# EAGLE design kopping_c (EAGLE 7.2.0)
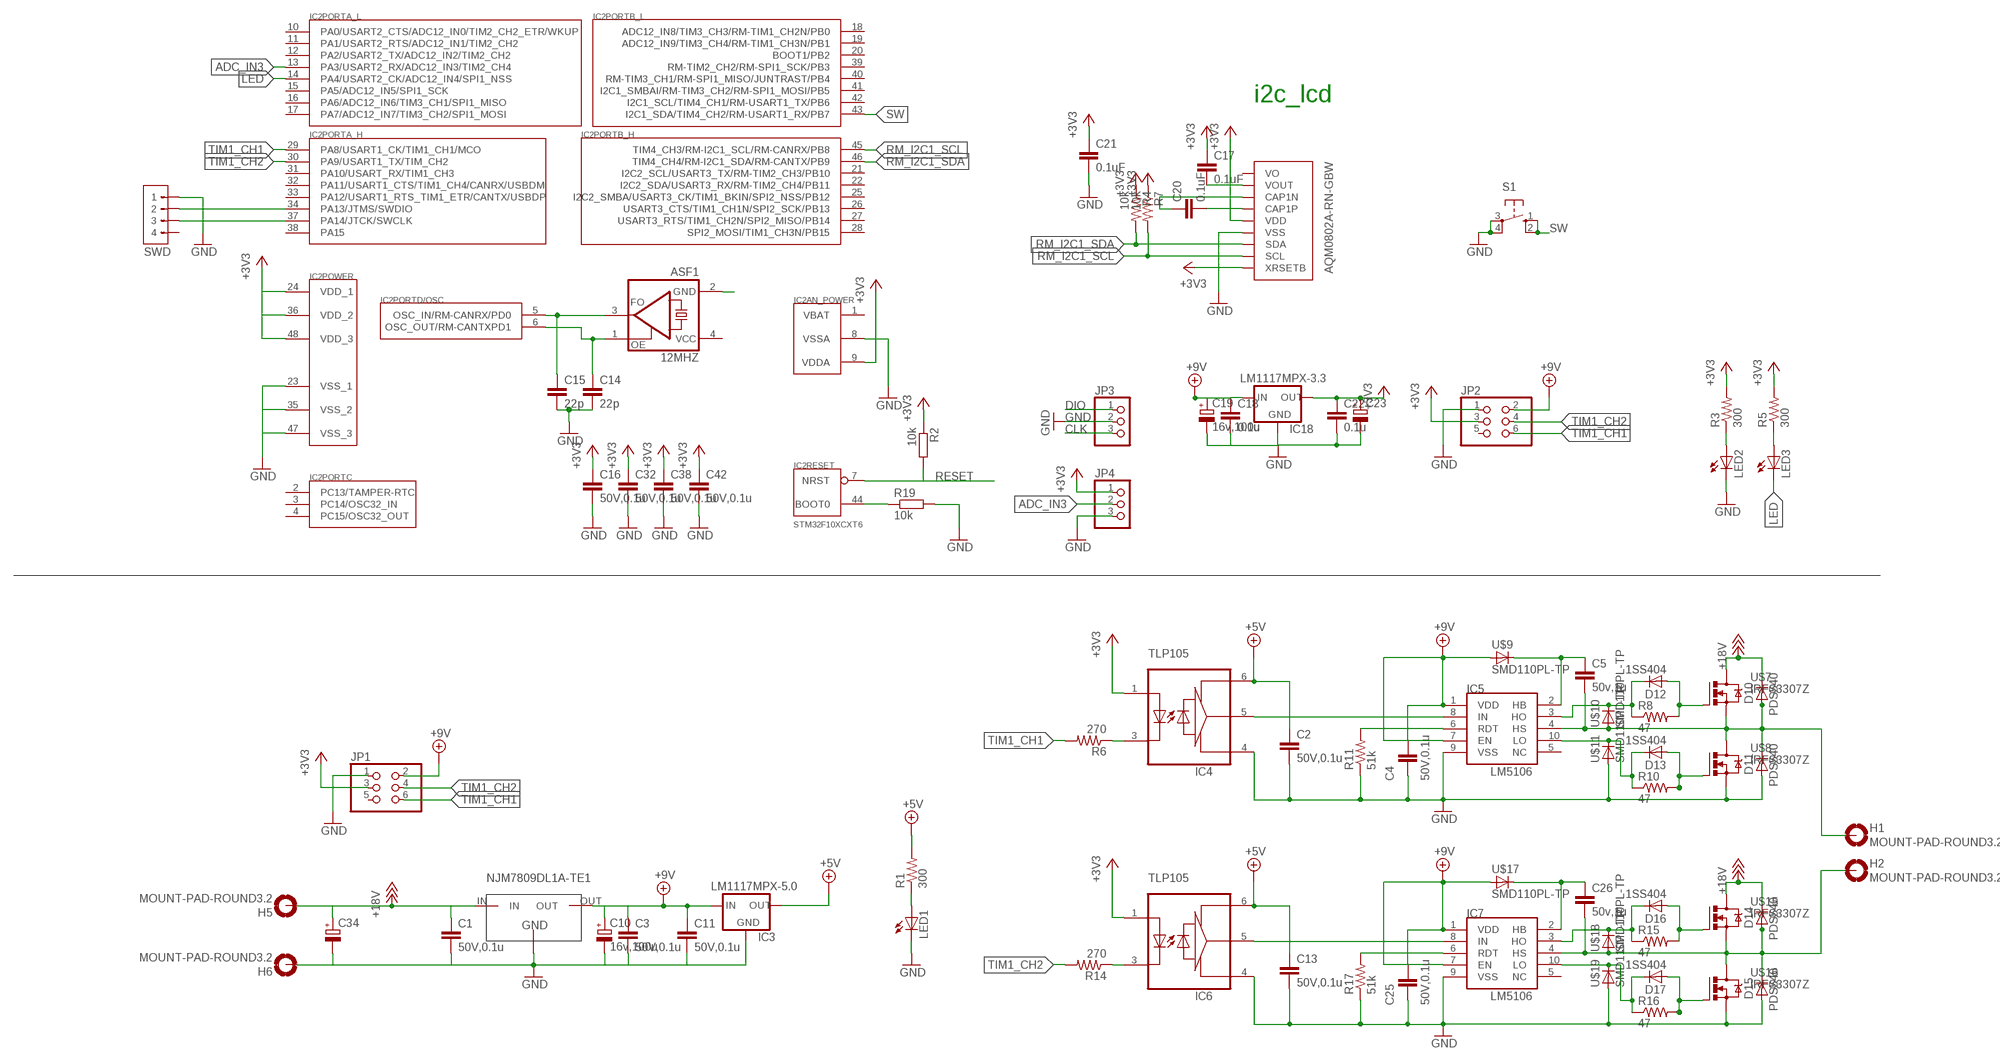
[diagram p0: schematic, sheet 1]

## Parts
12MHZ  ASF1  [ASF]
AQM0802A-RN-GBW  AQM0802A-RN-GBW  [AQM0802]
C1  50V,0.1u  C-EUC0603  [C0603]
C2  50V,0.1u  C-EUC0603  [C0603]
C3  50V,0.1u  C-EUC0603  [C0603]
C4  50V,0.1u  C-EUC0603  [C0603]
C5  50v,1u  C-EUC0603  [C0603]
C10  16v,100u  CPOL-EU153CLV-0605  [153CLV-0605]
C11  50V,0.1u  C-EUC0603  [C0603]
C13  50V,0.1u  C-EUC0603  [C0603]
C14  22p  C-EUC0603  [C0603]
C15  22p  C-EUC0603  [C0603]
C16  50V,0.1u  C-EUC0603K  [C0603K]
C17  0.1uF  C-EUC0603  [C0603]
C18  0.1u  C-EUC0603  [C0603]
C19  16v,100u  CPOL-EU153CLV-0605  [153CLV-0605]
C20  0.1uF  C-EUC0603  [C0603]
C21  0.1uF  C-EUC0603  [C0603]
C22  0.1u  C-EUC0603K  [C0603K]
C23  CPOL-EU153CLV-0505  [153CLV-0505]
C25  50V,0.1u  C-EUC0603  [C0603]
C26  50v,1u  C-EUC0603  [C0603]
C32  50V,0.1u  C-EUC0603K  [C0603K]
C34  CPOL-EUE7.5-16  [E7,5-16]
C38  50V,0.1u  C-EUC0603K  [C0603K]
C42  50V,0.1u  C-EUC0603K  [C0603K]
D10  PDS540  [POWER_DI_5]
D11  PDS540  [POWER_DI_5]
D12  1SS404  [USC(1.25X2.5)]
D13  1SS404  [USC(1.25X2.5)]
D14  PDS540  [POWER_DI_5]
D15  PDS540  [POWER_DI_5]
D16  1SS404  [USC(1.25X2.5)]
D17  1SS404  [USC(1.25X2.5)]
H1  MOUNT-PAD-ROUND3.2  [3,2-PAD]
H2  MOUNT-PAD-ROUND3.2  [3,2-PAD]
H5  MOUNT-PAD-ROUND3.2  [3,2-PAD]
H6  MOUNT-PAD-ROUND3.2  [3,2-PAD]
IC2  STM32F10XCXT6  [TQFP48]
IC3  LM1117MPX-5.0  LM1117  [SOT223]
IC4  TLP105  TLP117  [MFSOP6]
IC5  LM5106  [MSOP10]
IC6  TLP105  TLP117  [MFSOP6]
IC7  LM5106  [MSOP10]
IC18  LM1117MPX-3.3  LM1117  [SOT223]
JP1  PINHD-2X3  [2X03]
JP2  PINHD-2X3  [2X03]
JP3  PINHD-1X3/90  [1X03/90]
JP4  PINHD-1X3/90  [1X03/90]
LED1  LEDCHIPLED_1206  [CHIPLED_1206]
LED2  LEDCHIPLED_1206  [CHIPLED_1206]
LED3  LEDCHIPLED_1206  [CHIPLED_1206]
R1  300  R-US_M2012  [M2012]
R2  10k  R-EU_R0603  [R0603]
R3  300  R-US_M2012  [M2012]
R4  10k  R-US_R0603  [R0603]
R5  300  R-US_M2012  [M2012]
R6  270  R-US_R0603  [R0603]
R7  10k  R-US_R0603  [R0603]
R8  47  R-US_R0603  [R0603]
R10  47  R-US_R0603  [R0603]
R11  51k  R-US_R0603  [R0603]
R14  270  R-US_R0603  [R0603]
R15  47  R-US_R0603  [R0603]
R16  47  R-US_R0603  [R0603]
R17  51k  R-US_R0603  [R0603]
R19  10k  R-EU_R0603  [R0603]
S1  10-XX  [B3F-10XX]
SWD  TOP_TYPE_4PIN  [TOP_TYPE_4PIN]
U$3  TO252  [TO252]
U$7  IRFS3307Z  [IRFS3307Z]
U$8  IRFS3307Z  [IRFS3307Z]
U$9  SMD110PL-TP  [SOD123]
U$10  SMD110PL-TP  [SOD123]
U$11  SMD110PL-TP  [SOD123]
U$15  IRFS3307Z  [IRFS3307Z]
U$16  IRFS3307Z  [IRFS3307Z]
U$17  SMD110PL-TP  [SOD123]
U$18  SMD110PL-TP  [SOD123]
U$19  SMD110PL-TP  [SOD123]

## Nets
+3V3: AQM0802A-RN-GBW.P$5(VDD) AQM0802A-RN-GBW.P$9(XRSETB) C16.1 C17.1 C21.1 C22.1 C23.+ C32.1 C38.1 C42.1 IC2.9(AN_POWER:VDDA) IC2.24(POWER:VDD_1) IC2.36(POWER:VDD_2) IC2.48(POWER:VDD_3) IC4.1 IC6.1 IC18.2(OUT1) IC18.4(OUT) JP1.3 JP2.3 JP4.1 R2.1 R3.2 R4.1 R5.2 R7.1
+5V: C2.1 C13.1 IC3.2(OUT1) IC3.4(OUT) IC4.6(VCC) IC6.6(VCC) R1.2
+9V: C3.1 C4.1 C10.+ C11.1 C18.1 C19.+ C25.1 IC3.3(IN) IC5.1(VDD) IC5.7(EN) IC7.1(VDD) IC7.7(EN) IC18.3(IN) JP1.2 JP2.2 U$3.OUT U$9.A U$17.A
+18V: C1.1 C34.+ D10.K(C) D14.K(C) H5.B3,2(MOUNT) U$3.IN U$7.2(D1) U$15.2(D1)
ADC_IN3: IC2.13(PORTA_L:PA3/USART2_RX/ADC12_IN3/TIM2_CH4) JP4.2
CLK: IC2.37(PORTA_H:PA14/JTCK/SWCLK) JP3.3 SWD.3
DIO: IC2.34(PORTA_H:PA13/JTMS/SWDIO) JP3.1 SWD.2
GND: AQM0802A-RN-GBW.P$6(VSS) C1.2 C2.2 C3.2 C4.2 C10.- C11.2 C13.2 C14.2 C15.2 C16.2 C18.2 C19.- C21.2 C22.2 C23.- C25.2 C32.2 C34.- C38.2 C42.2 D11.A1 D11.A2(A) D15.A1 D15.A2(A) H6.B3,2(MOUNT) IC2.8(AN_POWER:VSSA) IC2.23(POWER:VSS_1) IC2.35(POWER:VSS_2) IC2.47(POWER:VSS_3) IC3.1(GND) IC4.4(GND) IC5.9(VSS) IC6.4(GND) IC7.9(VSS) IC18.1(GND) JP1.1 JP2.1 JP3.2 JP4.3 LED1.C LED2.C R11.1 R17.1 R19.2 S1.3(P) S1.4(P1) SWD.1 U$3.GND U$8.3(S) U$11.A U$16.3(S) U$19.A
LED: IC2.14(PORTA_L:PA4/USART2_CK/ADC12_IN4/SPI1_NSS) LED3.C
N$1: AQM0802A-RN-GBW.P$4(CAP1P) C20.2
N$2: AQM0802A-RN-GBW.P$3(CAP1N) C20.1
N$3: LED1.A R1.1
N$7: LED2.A R3.1
N$9: IC2.44(RESET:BOOT0) R19.1
N$10 [VCC]: 12MHZ.2(GND)
N$11: 12MHZ.3(FO) C15.1 IC2.5(PORTD/OSC:OSC_IN/RM-CANRX/PD0)
N$12: 12MHZ.1(OE) C14.1 IC2.6(PORTD/OSC:OSC_OUT/RM-CANTXPD1)
N$13: IC4.3 R6.1
N$14: IC6.3 R14.1
N$15: AQM0802A-RN-GBW.P$2(VOUT) C17.2
N$16: LED3.A R5.1
N$17: IC4.5 IC5.8(IN)
N$18: C5.2 D10.A1 D10.A2(A) D11.K(C) H1.B3,2(MOUNT) IC5.4(HS) U$7.3(S) U$8.2(D1) U$10.A
N$19: D12.A R8.2 U$7.1(G1)
N$20: D13.A R10.2 U$8.1(G1)
N$21: D12.K(C) IC5.3(HO) R8.1 U$10.K(C)
N$22: D13.K(C) IC5.10(LO) R10.1 U$11.K(C)
N$23: C5.1 IC5.2(HB) U$9.K(C)
N$24: IC5.6(RDT) R11.2
N$28: IC6.5 IC7.8(IN)
N$29: C26.2 D14.A1 D14.A2(A) D15.K(C) H2.B3,2(MOUNT) IC7.4(HS) U$15.3(S) U$16.2(D1) U$18.A
N$32: D16.A R15.2 U$15.1(G1)
N$33: D17.A R16.2 U$16.1(G1)
N$35: D16.K(C) IC7.3(HO) R15.1 U$18.K(C)
N$36: D17.K(C) IC7.10(LO) R16.1 U$19.K(C)
N$37: C26.1 IC7.2(HB) U$17.K(C)
N$39: IC7.6(RDT) R17.2
RESET: IC2.7(RESET:NRST) R2.2
RM_I2C1_SCL: AQM0802A-RN-GBW.P$8(SCL) IC2.45(PORTB_H:TIM4_CH3/RM-I2C1_SCL/RM-CANRX/PB8) R7.2
RM_I2C1_SDA: AQM0802A-RN-GBW.P$7(SDA) IC2.46(PORTB_H:TIM4_CH4/RM-I2C1_SDA/RM-CANTX/PB9) R4.2
SW: IC2.43(PORTB_L:I2C1_SDA/TIM4_CH2/RM-USART1_RX/PB7) S1.1(S) S1.2(S1)
TIM1_CH1: IC2.29(PORTA_H:PA8/USART1_CK/TIM1_CH1/MCO) JP1.6 JP2.6 R6.2
TIM1_CH2: IC2.30(PORTA_H:PA9/USART1_TX/TIM_CH2) JP1.4 JP2.4 R14.2
Unconnected: AQM0802A-RN-GBW.P$1(VO) IC2.2(PORTC:PC13/TAMPER-RTC) IC2.3(PORTC:PC14/OSC32_IN) IC2.4(PORTC:PC15/OSC32_OUT) IC2.10(PORTA_L:PA0/USART2_CTS/ADC12_IN0/TIM2_CH2_ETR/WKUP) IC2.11(PORTA_L:PA1/USART2_RTS/ADC12_IN1/TIM2_CH2) IC2.12(PORTA_L:PA2/USART2_TX/ADC12_IN2/TIM2_CH2) IC2.15(PORTA_L:PA5/ADC12_IN5/SPI1_SCK) IC2.16(PORTA_L:PA6/ADC12_IN6/TIM3_CH1/SPI1_MISO) IC2.17(PORTA_L:PA7/ADC12_IN7/TIM3_CH2/SPI1_MOSI) IC2.18(PORTB_L:ADC12_IN8/TIM3_CH3/RM-TIM1_CH2N/PB0) IC2.19(PORTB_L:ADC12_IN9/TIM3_CH4/RM-TIM1_CH3N/PB1) IC2.20(PORTB_L:BOOT1/PB2) IC2.21(PORTB_H:I2C2_SCL/USART3_TX/RM-TIM2_CH3/PB10) IC2.22(PORTB_H:I2C2_SDA/USART3_RX/RM-TIM2_CH4/PB11) IC2.25(PORTB_H:I2C2_SMBA/USART3_CK/TIM1_BKIN/SPI2_NSS/PB12) IC2.26(PORTB_H:USART3_CTS/TIM1_CH1N/SPI2_SCK/PB13) IC2.27(PORTB_H:USART3_RTS/TIM1_CH2N/SPI2_MISO/PB14) IC2.28(PORTB_H:SPI2_MOSI/TIM1_CH3N/PB15) IC2.31(PORTA_H:PA10/USART_RX/TIM1_CH3) IC2.32(PORTA_H:PA11/USART1_CTS/TIM1_CH4/CANRX/USBDM) IC2.33(PORTA_H:PA12/USART1_RTS_TIM1_ETR/CANTX/USBDP) IC2.38(PORTA_H:PA15) IC2.39(PORTB_L:RM-TIM2_CH2/RM-SPI1_SCK/PB3) IC2.40(PORTB_L:RM-TIM3_CH1/RM-SPI1_MISO/JUNTRAST/PB4) IC2.41(PORTB_L:I2C1_SMBAI/RM-TIM3_CH2/RM-SPI1_MOSI/PB5) IC2.42(PORTB_L:I2C1_SCL/TIM4_CH1/RM-USART1_TX/PB6) IC5.5(NC) IC7.5(NC) JP1.5 JP2.5 SWD.4

## Notes on the sheet
- i2c_lcd
- TLP105
- TLP105

## Power pins joined to a net without a drawn wire
VBAT: IC2.1(AN_POWER:VBAT)
VCC: 12MHZ.4(VCC)

## Library data of the parts
12MHZ = crystal:ASF*: CRYSTAL CLOCK OSCILLATORS 5.0 Vdc or 3.3 Vdc - LOW PROFILE ULTRA MINIATURE CERAMIC SURFACE MOUNT Source: http://www.abracon.com/Oscillators/asf1-L-L1.pdf
AQM0802A-RN-GBW = densikit:AQM0802A-RN-GBW
C1-C5 C11 C13-C15 C18 C25 C26 = rcl:C-EU: CAPACITOR, European symbol
C10 C19 C23 C34 = rcl:CPOL-EU: POLARIZED CAPACITOR, European symbol
C16 C17 C20-C22 C32 C38 C42 = resistor:C-EU: CAPACITOR, European symbol
D10 D11 D14 D15 = Diode:PDS540
D12 D13 D16 D17 = Diode:1SS404
H1 H2 H5 H6 = holes:MOUNT-PAD-ROUND: MOUNTING PAD, round
IC2 = stm32:STM32F10XCXT6: ST STM32F101/103 48pin LQFP
IC3 IC18 = VoltageRegulator:LM1117
IC4 IC6 = PhotoCoupler:TLP117
IC5 IC7 = MotorDriver5x:LM5106
JP1 JP2 = pinhead:PINHD-2X3: PIN HEADER
JP3 JP4 = pinhead:PINHD-1X3: PIN HEADER
LED1-LED3 = led:LED: LED OSRAM: - CHIPLED LG R971, LG N971, LY N971, LG Q971, LY Q971, LO R971, LY R971 LH N974, LH R974 LS Q976, LO Q976, LY Q976 LO Q996 - Hyper CHIPLED LW Q18S LB Q993, LB Q99A, LB R99A - SideLED LS A670, LO A670, LY A670, LG A670, LP A670 LB A673, LV A673, LT A673, LW A673 LH A674 LY A675 LS A676, LA A676, LO A676, LY A676, LW A676 LS A679, LY A679, LG A679 - Hyper Micro SIDELED® LS Y876, LA Y876, LO Y876, LY Y876 LT Y87S - SmartLED LW L88C, LW L88S LB L89C, LB L89S, LG L890 LS L89K, LO L89K, LY L89K LS L896, LA L896, LO L896, LY L896 - TOPLED LS T670, LO T670, LY T670, LG T670, LP T670 LSG T670, LSP T670, LSY T670, LOP T670, LYG T670 LG T671, LOG T671, LSG T671 LB T673, LV T673, LT T673, LW T673 LH T674 LS T676, LA T676, LO T676, LY T676, LB T676, LH T676, LSB T676, LW T676 LB T67C, LV T67C, LT T67C, LS T67K, LO T67K, LY T67K, LW E67C LS E67B, LA E67B, LO E67B, LY E67B, LB E67C, LV E67C, LT E67C LW T67C LS T679, LY T679, LG T679 LS T770, LO T770, LY T770, LG T770, LP T770 LB T773, LV T773, LT T773, LW T773 LH T774 LS E675, LA E675, LY E675, LS T675 LS T776, LA T776, LO T776, LY T776, LB T776 LHGB T686 LT T68C, LB T68C - Hyper Mini TOPLED® LB M676 - Mini TOPLED Santana® LG M470 LS M47K, LO M47K, LY M47K Source: http://www.osram.convergy.de LUXEON: - LUMILED® LXK2-PW12-R00, LXK2-PW12-S00, LXK2-PW14-U00, LXK2-PW14-V00 LXK2-PM12-R00, LXK2-PM12-S00, LXK2-PM14-U00 LXK2-PE12-Q00, LXK2-PE12-R00, LXK2-PE12-S00, LXK2-PE14-T00, LXK2-PE14-U00 LXK2-PB12-K00, LXK2-PB12-L00, LXK2-PB12-M00, LXK2-PB14-N00, LXK2-PB14-P00, LXK2-PB14-Q00 LXK2-PR12-L00, LXK2-PR12-M00, LXK2-PR14-Q00, LXK2-PR14-R00 LXK2-PD12-Q00, LXK2-PD12-R00, LXK2-PD12-S00 LXK2-PH12-R00, LXK2-PH12-S00 LXK2-PL12-P00, LXK2-PL12-Q00, LXK2-PL12-R00 Source: www.luxeon.com KINGBRIGHT: KA-3528ASYC Source: www.kingbright.com
R1 R3 R5 R11 R17 = rcl:R-US_: RESISTOR, American symbol
R2 R19 = rcl:R-EU_: RESISTOR, European symbol
R4 R6-R8 R10 R14-R16 = resistor:R-US_: RESISTOR, American symbol
S1 = switch-omron:10-XX: OMRON SWITCH; MPN: B3F-1000; OC_FARNELL: 176432; OC_NEWARK: 36M3542
SWD = GHconnector:TOP_TYPE_4PIN
U$3 = to252:TO252
U$7 U$8 U$15 U$16 = IRFS3307Z:IRFS3307Z
U$9-U$11 U$17-U$19 = SMD110PL-TP:SMD110PL-TP

## Board
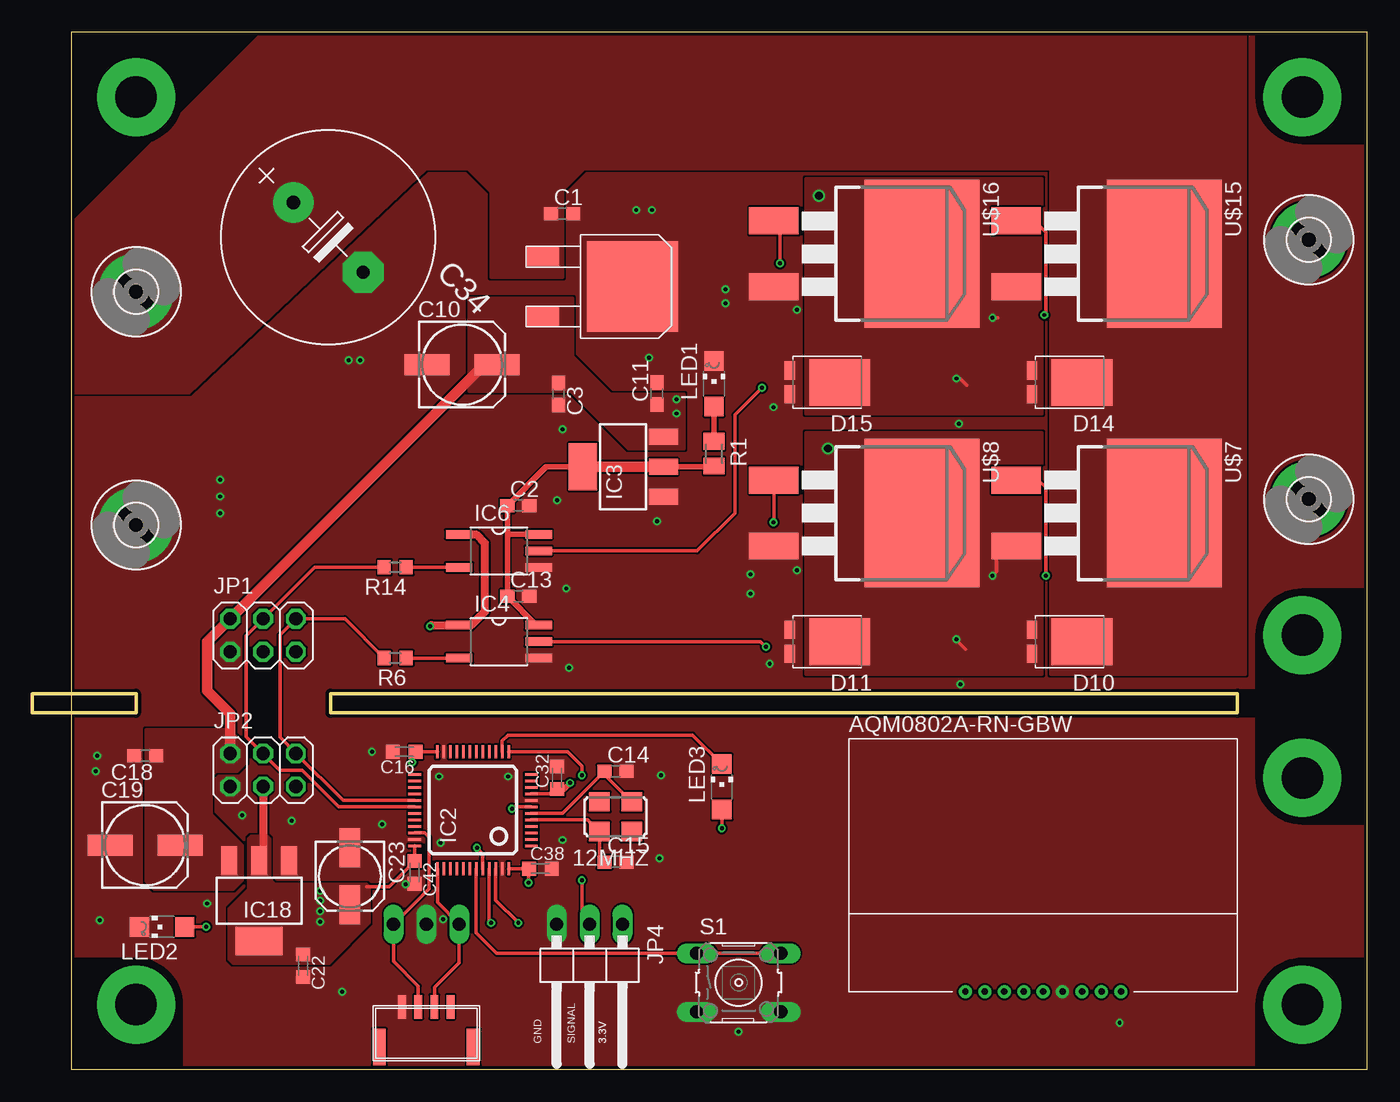
[diagram p1: board, top side]
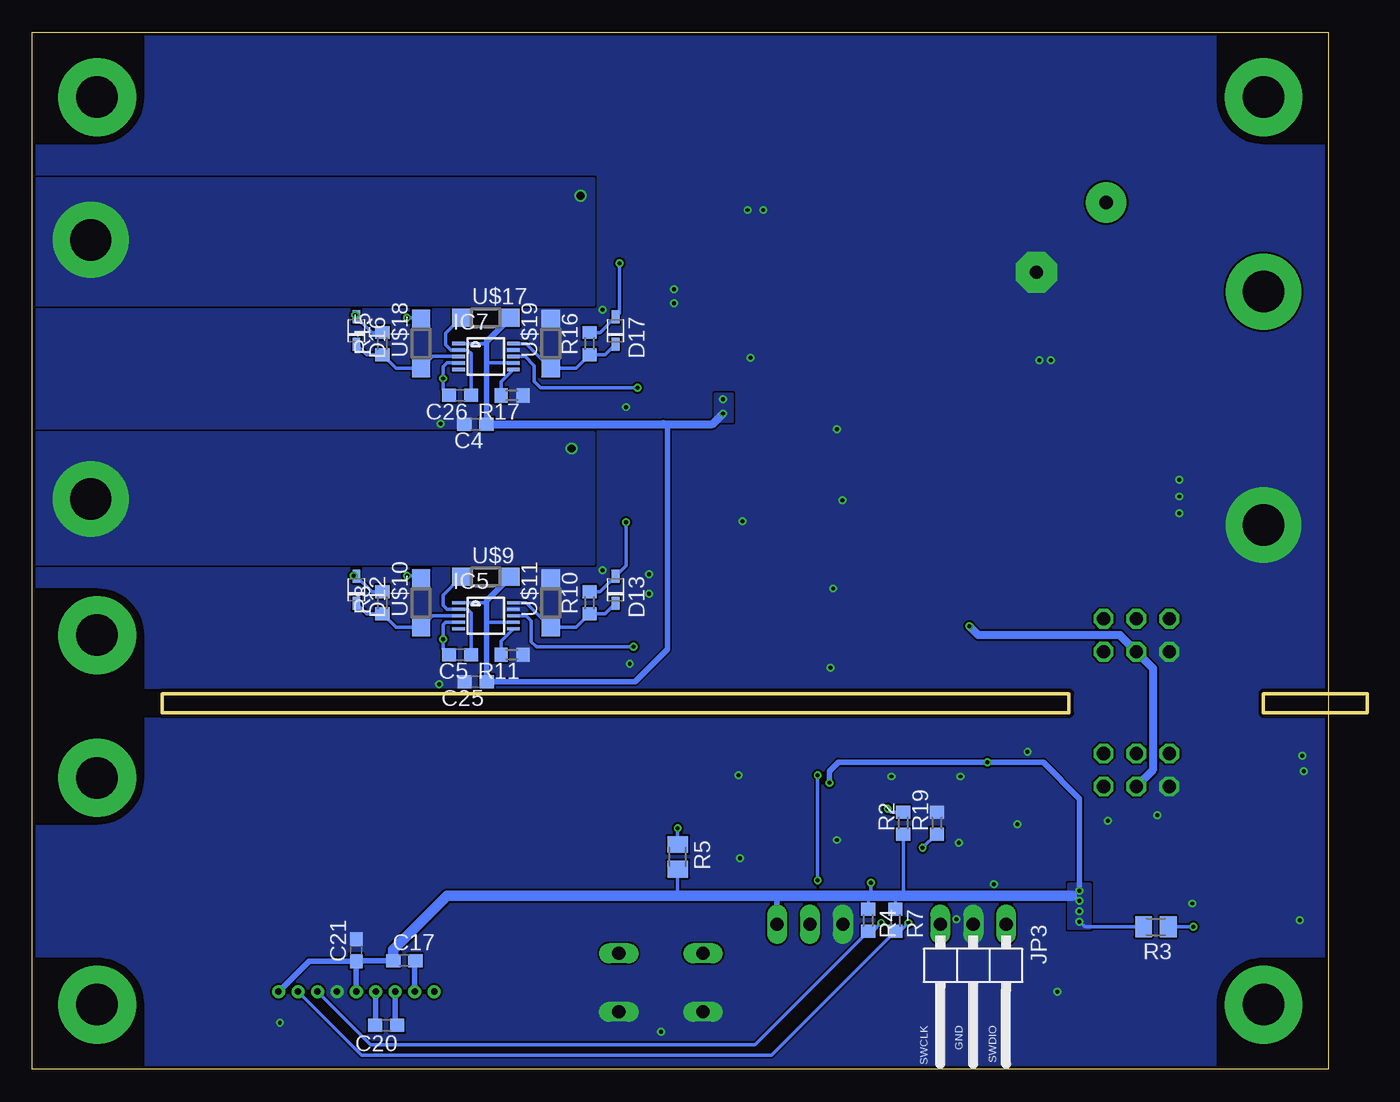
[diagram p2: board, bottom side, seen from below]

Size 103 x 80 mm. Coordinates in mm from the lower left corner, seen from the top.
Outline: 3,0 103,0 103,80 3,80 3,0
Outline: 23,29 93,29 93,27.5 23,27.5 23,29
Outline: 0,29 8,29 8,27.5 0,27.5 0,29
Copper layers (1*16): Top 0.035mm / dielectric 1.5mm / Bottom 0.035mm
Design rules "default *": minimum track width 6mil, minimum drill 12mil, track to track 6mil, track to pad 6mil, pad to pad 6mil, via to via 6mil, smd to smd 0mil, copper to edge 10mil, drill to drill 10mil, minimum pad ring 10mil, minimum via ring 6mil, stop-mask expansion 2mil, vias tented up to drill 100mil, thermal gap 10mil
tRestrict: 22 lines
bRestrict: 22 lines

### Footprints (pad centres in the part's own frame; a part is rotated, then mirrored left to right if it is on the bottom)
ASF = smd 1.6 x 1.5: 1 -1.25,-1.15; 2 1.25,-1.15; 3 1.25,1.15; 4 -1.25,1.15
AQM0802 = drill 0.5: P$1 9,0; P$2 10.5,0; P$3 12,0; P$4 13.5,0; P$5 15,0; P$6 16.5,0; P$7 18,0; P$8 19.5,0; P$9 21,0
C0603 = smd 1.1 x 1: 1 -0.85,0; 2 0.85,0
153CLV-0605 = smd 3.5 x 1.6: + 2.7,0; - -2.7,0
C0603K = smd 1.05 x 1.08: 1 -0.875,0; 2 0.875,0
153CLV-0505 = smd 3 x 1.6: + 2.2,0; - -2.2,0
E7,5-16 = drill 1.016 pad 3.15: + -3.81,0 | drill 1.016 pad 3.15 octagon: - 3.81,0
POWER_DI_5 = smd 0.8 x 1.4: A1 3.87,0.92; A2 3.87,-0.92 | smd 4.7 x 3.6: K 0,0
USC(1.25X2.5) = smd 1 x 0.6: A -1.05,0; K 1.05,0
3,2-PAD = drill 3.2 pad 5.842: B3,2 0,0
TQFP48 = smd 0.2 x 1: 1 -2.75,-4.5; 2 -2.25,-4.5; 3 -1.75,-4.5; 4 -1.25,-4.5; 5 -0.75,-4.5; 6 -0.25,-4.5; 7 0.25,-4.5; 8 0.75,-4.5; 9 1.25,-4.5; 10 1.75,-4.5; 11 2.25,-4.5; 12 2.75,-4.5; 25 2.75,4.5; 26 2.25,4.5; 27 1.75,4.5; 28 1.25,4.5; 29 0.75,4.5; 30 0.25,4.5; 31 -0.25,4.5; 32 -0.75,4.5; 33 -1.25,4.5; 34 -1.75,4.5; 35 -2.25,4.5; 36 -2.75,4.5 | smd 1 x 0.2: 13 4.5,-2.75; 14 4.5,-2.25; 15 4.5,-1.75; 16 4.5,-1.25; 17 4.5,-0.75; 18 4.5,-0.25; 19 4.5,0.25; 20 4.5,0.75; 21 4.5,1.25; 22 4.5,1.75; 23 4.5,2.25; 24 4.5,2.75; 37 -4.5,2.75; 38 -4.5,2.25; 39 -4.5,1.75; 40 -4.5,1.25; 41 -4.5,0.75; 42 -4.5,0.25; 43 -4.5,-0.25; 44 -4.5,-0.75; 45 -4.5,-1.25; 46 -4.5,-1.75; 47 -4.5,-2.25; 48 -4.5,-2.75
SOT223 = smd 1.219 x 2.235: 1 -2.311,-3.099; 2 0,-3.099; 3 2.311,-3.099 | smd 3.6 x 2.2: 4 0,3.099
MFSOP6 = smd 0.66 x 2.032: 1 -1.27,-3.073; 3 1.27,-3.073; 4 1.27,3.073; 5 0,3.073; 6 -1.27,3.073
MSOP10 = smd 0.25 x 1: 1 -1,-2.113; 2 -0.5,-2.113; 3 0,-2.113; 4 0.5,-2.113; 5 1,-2.113; 6 1,2.113; 7 0.5,2.113; 8 0,2.113; 9 -0.5,2.113; 10 -1,2.113
2X03 = drill 1.016 octagon: 1 -2.54,-1.27; 2 -2.54,1.27; 3 0,-1.27; 4 0,1.27; 5 2.54,-1.27; 6 2.54,1.27
1X03/90 = drill 1.016 long: 1 -2.54,-3.81; 2 0,-3.81; 3 2.54,-3.81
CHIPLED_1206 = smd 1.5 x 1.5: A 0,-1.75; C 0,1.75
M2012 = smd 1.3 x 1.6: 1 -0.95,0; 2 0.95,0
R0603 = smd 1 x 1.1: 1 -0.85,0; 2 0.85,0
B3F-10XX = drill 1.016 long: 1 -3.251,2.261; 2 3.251,2.261; 3 -3.251,-2.261; 4 3.251,-2.261
TOP_TYPE_4PIN = smd 0.6 x 1.8: 1 -1.875,2.025; 2 -0.625,2.025; 3 0.625,2.025; 4 1.875,2.025 | smd 1 x 2.8: P$1 -3.625,-1.075; P$2 3.625,-1.075
TO252 = smd 7 x 7: GND 0,0 | smd 1.5 x 2.5: IN -2.3,-6.9; OUT 2.3,-6.9
IRFS3307Z = smd 2.083 x 3.81: 1 2.54,-5.08; 3 7.62,-5.08 | smd 11.43 x 8.89: 2 5.08,6.35
SOD123 = smd 1.4 x 1.4: A 1.9,0; K -1.9,0

### Placement (x,y rotation side)
12MHZ  45,19.5 180 top
AQM0802A-RN-GBW  63,6 0 top
C1  40.88,66.01 0 top
C2  37.5,43.5 0 top
C3  40.61,52.1 270 top
C4  68.81,49.79 180 bottom
C5  70,32 180 bottom
C10  33.16,54.37 0 top
C11  48.19,52.14 90 top
C13  37.5,36.5 0 top
C14  45,23 0 top
C15  45,16 0 top
C16  28.7,24.5 180 top
C17  74.3,8.4 0 bottom
C18  8.7,24.2 180 top
C19  8.7,17.3 0 top
C20  75.7,3.4 180 bottom
C21  78,9.2 90 bottom
C22  20.9,8 270 top
C23  24.5,14.9 270 top
C25  68.79,29.91 180 bottom
C26  70,52 180 bottom
C32  40.5,22.5 90 top
C34  22.83,64.19 315 top
C38  39.2,15.5 0 top
C42  29.5,15.2 270 top
D10  81,33 180 top
D11  62.3,33 180 top
D12  78,37 270 bottom
D13  58,37 270 bottom
D14  81,53 180 top
D15  62.3,53 180 top
D16  78,57 270 bottom
D17  58,57 270 bottom
H1  98.5,44 0 top
H2  98.5,64 0 top
H5  8,60 0 top
H6  8,42 0 top
IC2  34,20 90 top
IC3  45.59,46.49 90 top
IC4  36,33 270 top
IC5  68,35 270 bottom
IC6  36,40 270 top
IC7  68,55 270 bottom
IC18  17.5,13 180 top
JP1  17.8,33.5 0 top
JP2  17.8,23.1 0 top
JP3  30.4,7.4 180 bottom
JP4  43,7.4 180 top
LED1  52.6,52.9 0 top
LED2  10,11 90 top
LED3  53.2,21.8 0 top
R1  52.6,47.5 270 top
R2  35.8,19 90 bottom
R3  16.3,11 180 bottom
R4  38.5,11.5 270 bottom
R5  53.2,16.4 270 bottom
R6  28,31.74 180 top
R7  36.4,11.5 270 bottom
R8  76,36 90 bottom
R10  60,36 90 bottom
R11  66,32 180 bottom
R14  28,38.74 180 top
R15  76,56 90 bottom
R16  60,56 90 bottom
R17  66,52 180 bottom
R19  33.2,19 90 bottom
S1  54.5,6.7 0 top
SWD  30.4,2.8 0 top
U$3  46.31,60.39 270 top
U$7  81,48 270 top
U$8  62.3,48 270 top
U$9  68,38 0 bottom
U$10  73,36 90 bottom
U$11  63,36 90 bottom
U$15  81,68 270 top
U$16  62.3,68 270 top
U$17  68,58 0 bottom
U$18  73,56 90 bottom
U$19  63,56 90 bottom

### Tracks (layer width: path | path; a pad name or v marks a point on that pad's centre or on a via)
+3V3  (via drill 0.3)
  Top 0.254: C16.1 IC2.24 | IC2.9 40.12,21.25 C32.1 | IC2.36 C42.1 27.52,14.1 25.8,14.1 | IC2.48 C38.1 38.3,15.47 v38.3,14.4
  Top 0.406: C32.1 41.02,21.62 v41.5,22.1 | C16.1 29.3,24.23 v29.3,23.7
  Top 0.61: IC6.1 34.23,41.27 34.9,40.6 34.9,35.3 33.87,34.27 IC4.1 30.77,34.27 v30.7,34.2 | JP2.3 17.8,16.4 IC18.2
  Bottom 0.254: R3.2 21.8,11 v22.2,11.4 | R7.1 36.4,13.4 | R4.1 38.5,13.3 38.6,13.4 | v38.3,14.4 38.3,13.5 38.4,13.4 | R2.1 35.8,13.5 35.7,13.4 | R5.2 53.2,13.4
  Bottom 0.406: C17.1 77.95,8.4 C21.1 | C21.1 81.65,8.35 AQM0802A-RN-GBW.P$9 | AQM0802A-RN-GBW.P$5 C21.1 | v41.5,22.1 41.5,23 40.8,23.7 v29.3,23.7 25,23.7 22.2,20.9 v22.2,13.8 | JP4.1 45.54,13.06 45.2,13.4
  Bottom 0.61: JP2.3 16.5,23.13 16.5,30.93 JP1.3 19.07,33.5 30,33.5 v30.7,34.2
  Bottom 0.813: 22.8,13.4 35.7,13.4 36.4,13.4 38.4,13.4 38.6,13.4 45.2,13.4 53.2,13.4 71,13.4 75.15,9.25 C17.1
  other vias: 22.2,13 22.2,12.2
  pour Top (no thermals): 16.9,18 18.1,18 18.3,17.8 18.3,14.7 18.7,14.3 25.8,14.3 26,14.1 26,11.3 22.9,8.2 15.5,8.2 15.2,8.5 15.2,12.4 16.7,13.9 16.7,17.8
  pour Bottom (no thermals): 21.4,14.3 23,14.3 23,10.9 21.4,10.9
+5V
  Top 0.406: IC4.6 38.88,34.27 C13.1 36.65,41.3 | 36.65,41.3 C2.1 39.64,46.49 IC3.4 | IC6.6 36.68,41.27 36.65,41.3 | R1.2 52.54,46.49 IC3.2
  Top 0.813: IC3.4 IC3.2
+9V  (via drill 0.3)
  Top 0.813: JP2.2 15.26,27.44 13.5,29.2 13.5,33.01 JP1.2 34.86,54.37 C10.+
  Bottom 0.254: IC7.7 67.96,54.5 | IC7.1 67.96,56 | IC5.7 67.94,34.5 | IC5.1 67.94,36
  Bottom 0.406: C4.1 67.96,54.5 67.96,56 67.96,56.14 U$17.A | 54.3,49.79 54,49.49 54,32.4 56.49,29.91 C25.1 67.94,34.5 67.94,36 67.94,36.16 U$9.A
  Bottom 0.61: C4.1 54.3,49.79 50.51,49.79 v49.7,50.6
  other vias: 49.7,51.7
  pour Top (no thermals): 8.8,26.2 15.2,26.2 16.5,24.9 16.5,23.7 15.8,23 14.2,23 13.8,22.6 13.8,19.7 16.2,17.3 16.2,14.6 15.5,13.9 9.4,13.9 8.8,14.5
  pour Top (no thermals): 33.7,59.5 41.7,59.5 41.7,52.3 33.7,52.3
  pour Top (no thermals): 41.1,55.6 44.6,52.1 50.3,52.1 50.3,47.9 46,47.9 41.1,52.8
  pour Bottom (no thermals): 50.3,52.1 50.3,50 49,50 49,52.1
+18V
  pour Top (no thermals): 78.6,30.5 93.6,30.5 93.6,82.3 20.1,82.3 1.8,64 1.8,52.2 12.1,52.2 30.4,69.5 78.6,69.5
  pour Top (no thermals): 43.3,71.1 43.3,70.2 41,67.9 40.9,67.8 40.9,66.2 40.9,61.1 35.4,61.1 35.4,67.7 33.5,69.6 35,71.1
ADC_IN3  (via drill 0.3)
  Top 0.254: IC2.13 41.3,24.5 42.4,23.4 v42.4,22.7 | v42.4,14.6 42.4,11.81 JP4.2
  Bottom 0.254: v42.4,22.7 v42.4,14.6
CLK
  Top 0.254: IC2.37 31.25,12.9 JP3.3 32.94,8.24 31.02,6.33 SWD.3
DIO
  Top 0.254: IC2.34 30.25,18.25 30.6,17.9 30.6,13.95 JP3.1 27.86,8.34 29.77,6.42 SWD.2
GND  (via drill 0.3)
  other vias: 14.5,45.5 14.5,44.2 14.5,42.9 24.4,54.7 25.3,54.7 46.6,66.3 47.8,66.3 53.5,60.2 53.5,59.1 47.6,54.9 40.9,49.4 40.5,43.9 48.2,42.3 55.4,38.2 55.4,36.7 41.2,37.1 41.4,31 5,24.2 4.9,23 16.2,19.6 83.9,3.6 13.5,12.8 71.5,49.8 71.6,29.7 59,38.5 56.9,31.3 59,58.6 57.2,51.1 28.8,14.3 5.2,11.5 31.7,11.6 23.9,6 54.5,2.9 26.2,24.5 36.7,22.6 31.4,22.6 48.5,22.7 48.4,16.3 40.9,17.7 31.5,17.5 20,19.2 27,18.9
  pour Bottom (rank 6, no thermals): -0.6,84.8 110.3,84.8 110.3,-6.5 -0.6,-6.5
  pour Top (rank 6, no thermals): -2.1,86.9 116.1,86.9 116.1,-12.8 -2.1,-12.8
LED
  Top 0.254: LED3.C 50.95,25.8 36.7,25.8 36.25,25.35 IC2.14
N$1
  Bottom 0.406: AQM0802A-RN-GBW.P$4 76.5,3.45 C20.2
N$2
  Bottom 0.406: AQM0802A-RN-GBW.P$3 75,3.55 C20.1
N$3
  Top 0.406: LED1.A R1.1
N$4  (via drill 3.2 pad 6)
  other vias: 8,75
N$5  (via drill 3.2 pad 6)
  other vias: 8,5
N$6  (via drill 3.2 pad 6)
  other vias: 98,5
N$7  (via drill 0.3)
  Top 0.254: LED2.A v13.4,11
  Bottom 0.254: v13.4,11 R3.1
N$8  (via drill 3.2 pad 6)
  other vias: 98,75
N$9  (via drill 0.3)
  Top 0.254: IC2.44 34.75,16.65 v34.3,17.1
  Bottom 0.254: v34.3,17.1 33.25,18.15 R19.1
N$11
  Top 0.254: IC2.5 42.85,19.25 12MHZ.3 43.75,16.4 C15.1
N$12
  Top 0.254: IC2.6 40.9,19.75 C14.1 44.15,22.75 12MHZ.1
N$13
  Top 0.254: R6.1 32.92,31.74 IC4.3
N$14
  Top 0.254: R14.1 32.92,38.74 IC6.3
N$15
  Bottom 0.406: AQM0802A-RN-GBW.P$2 73.5,8.35 C17.2
N$16  (via drill 0.3)
  Top 0.254: v53.2,18.6 LED3.A
  Bottom 0.254: R5.1 v53.2,18.6
N$17  (via drill 0.3)
  Top 0.254: v56.6,32.6 56.2,33 IC4.5
  Bottom 0.254: IC5.8 64.9,35 64.5,34.6 64.5,33 64.1,32.6 v56.6,32.6
N$18  (via drill 0.3, 0.6)
  Top 0.254: v71.3,33.2 71.3,33.1 72,32.4 | v74.1,38.1 74.4,38.4 74.4,39.6
  Bottom 0.254: IC5.4 71.1,34.5 71.3,34.3 v71.3,33.2 71.3,32.45 C5.2 | U$10.A 73.2,38.1 v74.1,38.1
  other vias: 61.4,47.9
  pour Top (no thermals): 59.7,49.1 77.9,49.1 77.9,30.5 59.7,30.5
  pour Bottom (no thermals): 59.7,49.1 106.5,49.1 106.5,39 59.7,39
N$19  (via drill 0.3)
  Top 0.254: v78.2,38.1 78.2,44.9 77.64,45.46 U$7.1
  Bottom 0.254: v78.2,38.1 78.05,38.1 D12.A 76.8,36.85 R8.2
N$20  (via drill 0.3)
  Top 0.254: U$8.1 57.22,42.22 v57.2,42.2
  Bottom 0.254: v57.2,42.2 57.2,38.85 D13.A 59.2,36.85 R10.2
N$21
  Bottom 0.254: IC5.3 72.1,35 U$10.K 74.95,34.1 R8.1 77.2,35.15 D12.K
N$22
  Bottom 0.254: IC5.10 64.9,36 U$11.K 61.05,34.1 R10.1 58.8,35.15 D13.K
N$23
  Bottom 0.254: C5.1 69.15,35.25 69.4,35.5 IC5.2 71,35.5 71.3,35.8 71.3,36.6 U$9.K
N$24
  Bottom 0.254: IC5.6 66.85,33.04 R11.2
N$25  (via drill 3.2 pad 6)
  other vias: 98,22.5
N$26  (via drill 3.2 pad 6)
  other vias: 98,33.5
N$28  (via drill 0.3)
  Top 0.254: v56.3,52.6 54.2,50.5 54.2,42.9 51.3,40 IC6.5
  Bottom 0.254: IC7.8 65,55 64.3,54.3 64.3,53.1 63.8,52.6 v56.3,52.6
N$29  (via drill 0.3, 0.6)
  Top 0.254: v71.3,53.3 71.6,53.3 72.1,52.8 | v74.1,58 74.5,58
  Bottom 0.254: IC7.4 71,54.5 71.3,54.2 v71.3,53.3 71.3,52.45 C26.2 | U$18.A 73.1,58 v74.1,58
  other vias: 60.7,67.4
  pour Top (no thermals): 59.7,50.6 77.9,50.6 77.9,68.7 59.7,68.7
  pour Bottom (no thermals): 59.7,68.7 103.9,68.7 103.9,59 59.7,59
N$32  (via drill 0.3)
  Top 0.254: U$15.1 77.34,65.46 78.2,64.6 78.2,58.3 v78.1,58.2
  Bottom 0.254: v78.1,58.2 78,58.1 D16.A 76.8,56.85 R15.2
N$33  (via drill 0.3)
  Top 0.254: v57.7,62.2 57.7,64.98 U$16.1
  Bottom 0.254: v57.7,62.2 57.7,58.35 D17.A 59.2,56.85 R16.2
N$35
  Bottom 0.254: IC7.3 72.1,55 U$18.K 74.95,54.1 R15.1 77.2,55.15 D16.K
N$36
  Bottom 0.254: IC7.10 64.9,56 U$19.K 61.05,54.1 R16.1 58.8,55.15 D17.K
N$37
  Bottom 0.254: C26.1 69.15,55.25 69.4,55.5 IC7.2 70.7,55.5 71.1,55.9 71.1,56.8 U$17.K
N$39
  Bottom 0.254: IC7.6 66.85,53.04 R17.2
RESET  (via drill 0.3)
  Top 0.254: IC2.7 37.15,20.25 v37,20.1
  Bottom 0.254: v37,20.1 36.75,19.85 R2.2
RM_I2C1_SCL  (via drill 0.3)
  Top 0.254: IC2.45 35.25,11.45 v35.4,11.3
  Bottom 0.254: v35.4,11.3 36.05,10.65 R7.2 45.95,1.1 77.6,1.1 AQM0802A-RN-GBW.P$8
RM_I2C1_SDA  (via drill 0.3)
  Top 0.254: IC2.46 35.75,13.05 v37.5,11.3
  Bottom 0.254: v37.5,11.3 38.15,10.65 R4.2 47.25,1.9 76.9,1.9 AQM0802A-RN-GBW.P$7
SW
  Top 0.254: IC2.43 34.25,10.55 35.84,8.96 S1.1 S1.2
TIM1_CH1
  Top 0.254: R6.2 24.12,34.77 JP1.6 19.1,33.53 19.1,25.61 JP2.6 23.96,20.75 IC2.29
TIM1_CH2
  Top 0.254: R14.2 21.77,38.74 JP1.4 16.5,33.47 16.5,25.67 JP2.4 19.07,23.1 20.8,23.1 23.65,20.25 IC2.30

### Text on the board
tNames: GND | SIGNAL | 3.3V | 3.3V
bNames: SWDIO | GND | SWCLK